# EasyEDA schematic sw63-display.json
TITLE: sw63 spacewatch; REV: 1.0; Date: 2019-05-05; Sheet: 1/1; Drawn By: Vaclav Mach; Company: xx0x
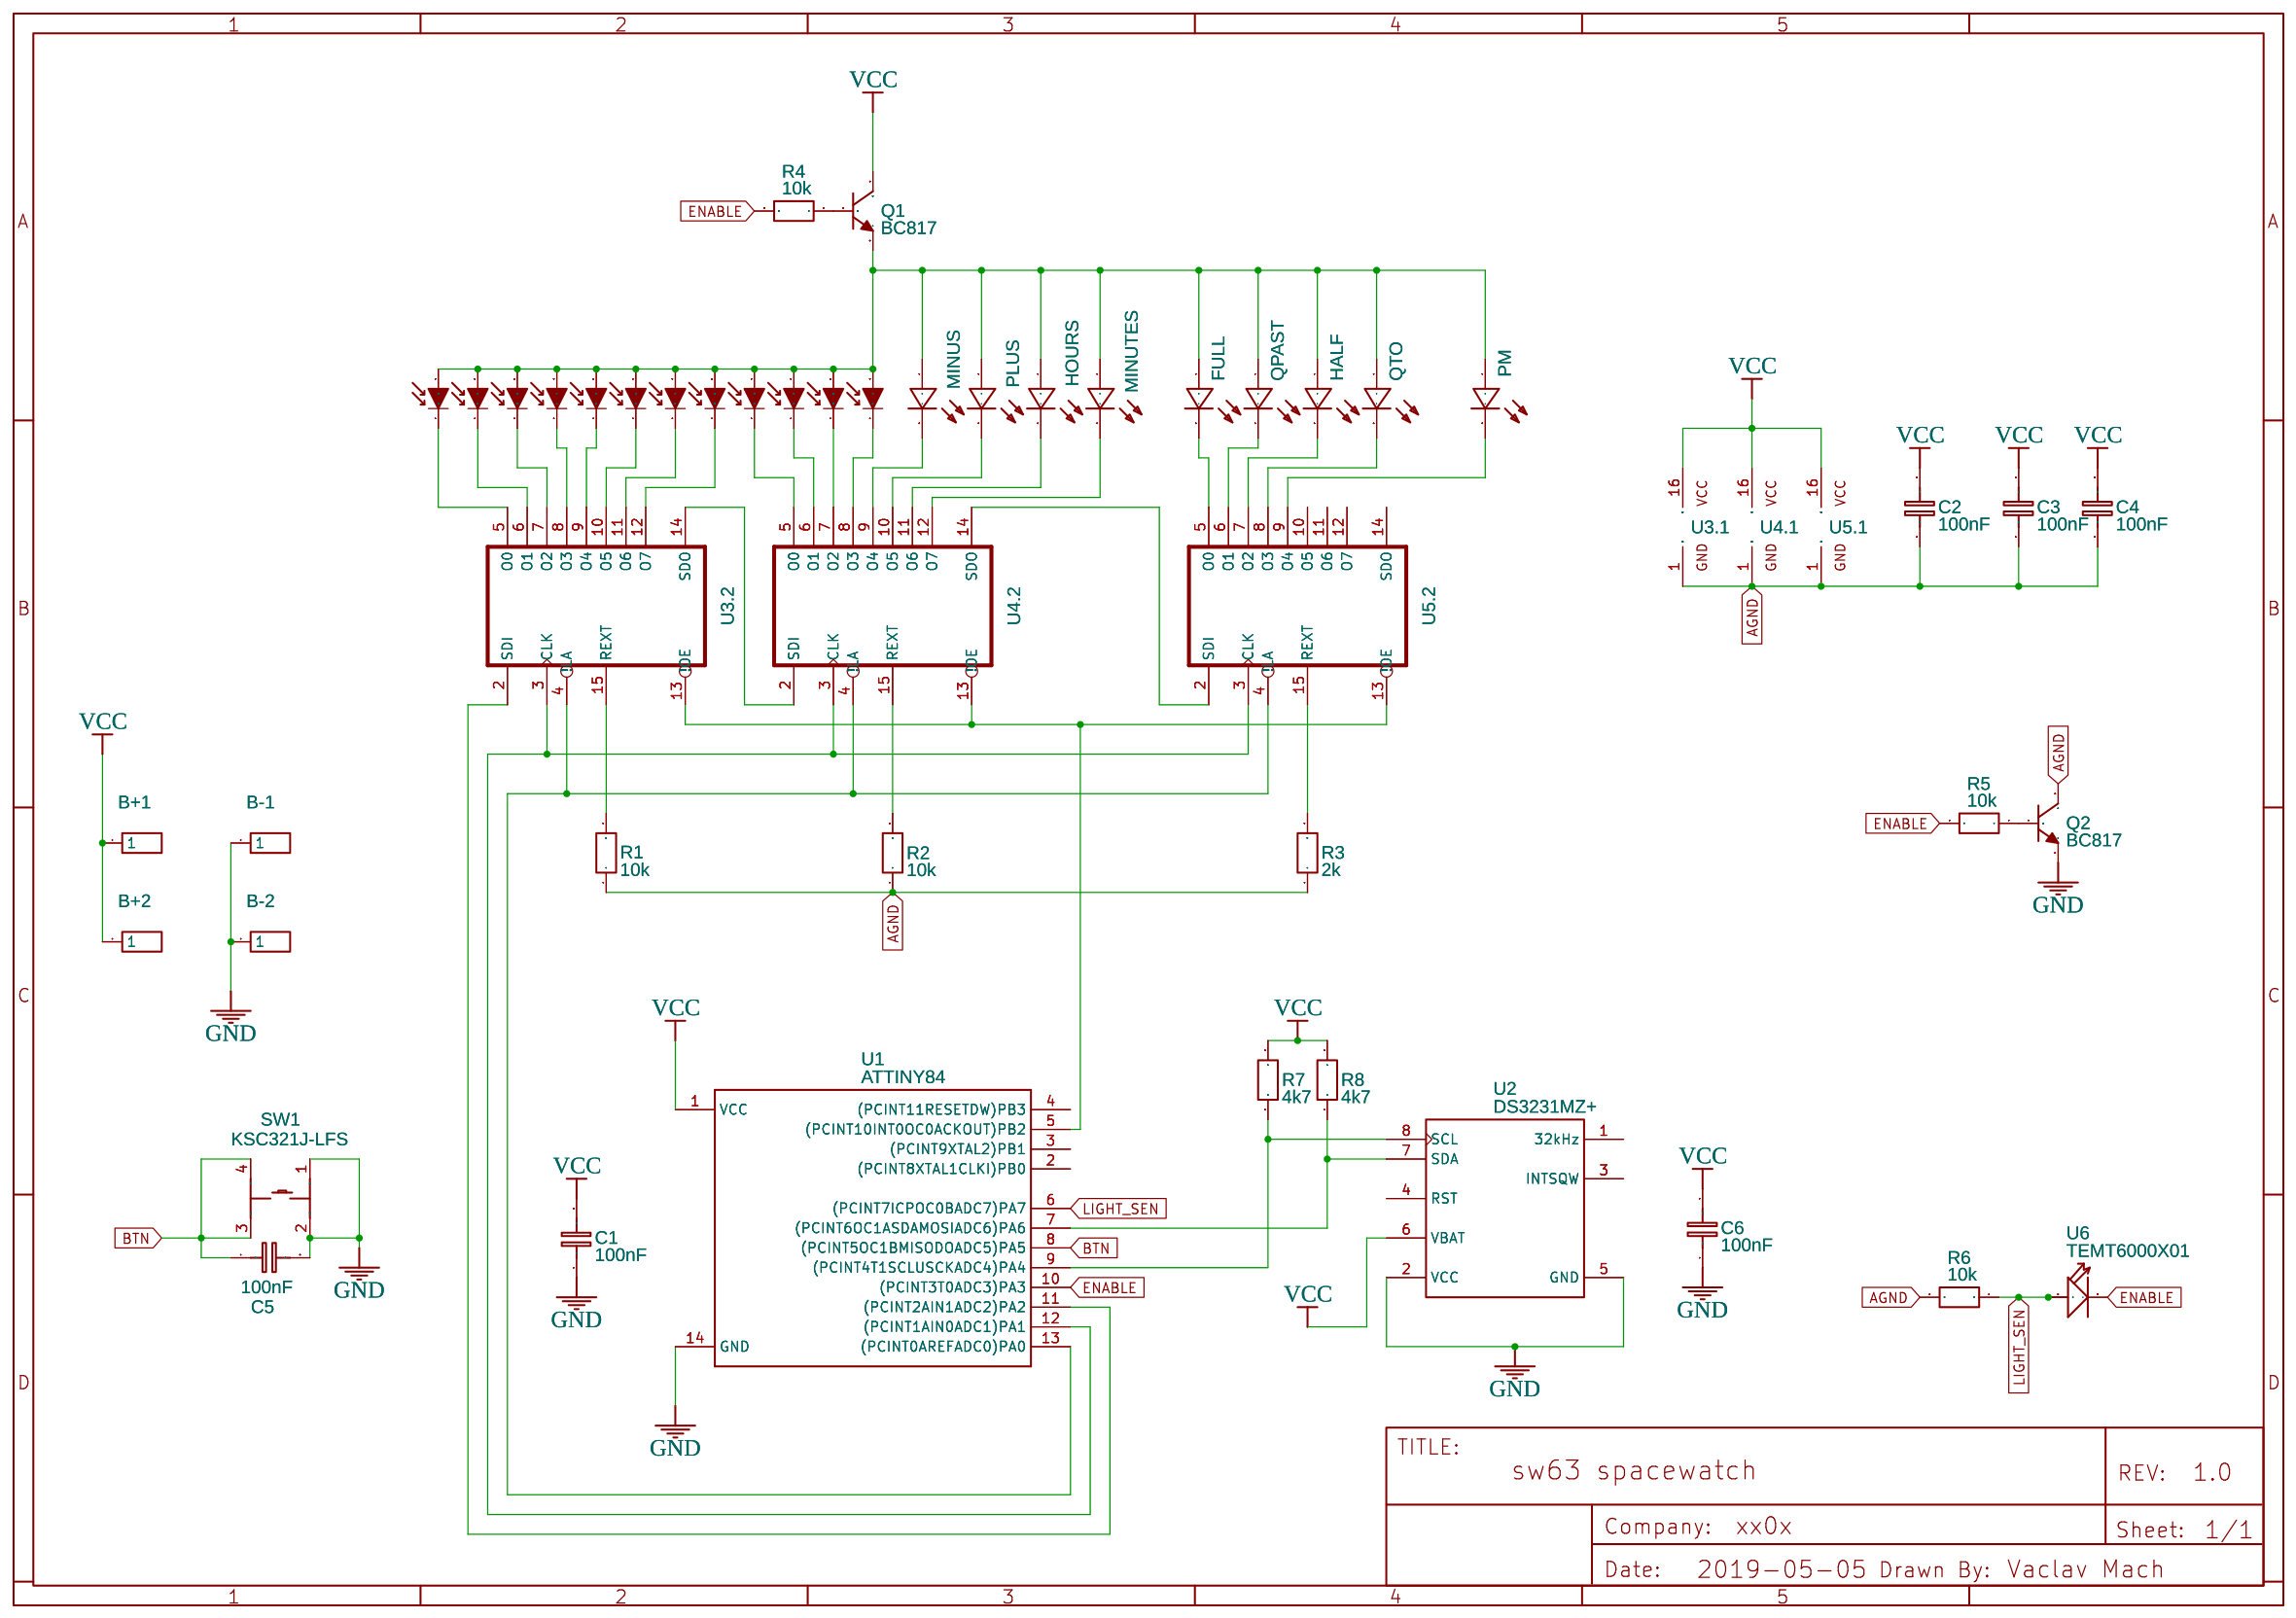
[diagram p0: schematic sheet]

## Parts
B+1  Header-Male-2.54_1x1  [ROUND-CONTACT]
B+2  Header-Male-2.54_1x1  [ROUND-CONTACT]
B-1  Header-Male-2.54_1x1  [ROUND-CONTACT]
B-2  Header-Male-2.54_1x1  [ROUND-CONTACT]
C1  100nF  [0603]
C2  100nF  [0603]
C3  100nF  [0603]
C4  100nF  [0603]
C5  100nF  [0603]
C6  100nF  [0603]
D1  LED  [LED_1206_NICE]
D2  LED  [LED_1206_NICE]
D3  LED  [LED_1206_NICE]
D4  LED  [LED_1206_NICE]
D5  LED  [LED_1206_NICE]
D6  LED  [LED_1206_NICE]
D7  LED  [LED_1206_NICE]
D8  LED  [LED_1206_NICE]
D9  LED  [LED_1206_NICE]
D10  LED  [LED_1206_NICE]
D11  LED  [LED_1206_NICE]
D12  LED  [LED_1206_NICE]
FULL  LED3.2x2  [LED-3.2X2-THT-RECTANGLE]
HALF  LED3.2x2  [LED-3.2X2-THT-RECTANGLE]
HOURS  LED-5MM  [LED-5MM/2.54]
MINUS  LED-5MM  [LED-5MM/2.54]
MINUTES  LED-5MM  [LED-5MM/2.54]
PLUS  LED-5MM  [LED-5MM/2.54]
PM  LED-3MM  [LED-3MM/2.54]
Q1  BC817  [SOT-23(SOT-23-3)]
Q2  BC817  [SOT-23(SOT-23-3)]
QPAST  LED3.2x2  [LED-3.2X2-THT-RECTANGLE]
QTO  LED3.2x2  [LED-3.2X2-THT-RECTANGLE]
R1  10k  [0603]
R2  10k  [0603]
R3  2k  [0603]
R4  10k  [0603]
R5  10k  [0603]
R6  10k  [0603]
R7  4k7  [0603]
R8  4k7  [0603]
SW1  KSC321J-LFS  [KSC341J]
U1  ATTINY84  [SO14]
U2  DS3231MZ+  [SOIC-8_150MIL]
U3  SCT2167CSSG  [SSOP16_OK]  (sections 1,2)
U4  SCT2167CSSG  [SSOP16_OK]  (sections 1,2)
U5  SCT2167CSSG  [SSOP16_OK]  (sections 1,2)
U6  TEMT6000X01  [SNR3-4X2X1.05MM_LARGER_PADS]

## Library data of the parts
C1-C6 = Cap_0805_EU: Manufacturer Part: ?
D1-D12 = -: Contributor: KiCAD; Manufacturer Part: LL-S150W-W2-1B; Supplier Part: LL-S150W-W2-1B; Manufacturer: LUCKY LIGHT; Supplier: TME
FULL HALF QPAST QTO = -: Supplier: TME; Manufacturer: LUCKY LIGHT; Manufacturer Part: LL-234YD2Q-1B; Supplier Part: LL-234YD2Q-1B
HOURS = -: Supplier: TME; Manufacturer: LUCKY LIGHT; Manufacturer Part: LL-504BD2E-B4-2B; Supplier Part: LL-504BD2E-B4-2B
MINUS = -: Supplier: TME; Manufacturer: LUCKY LIGHT; Manufacturer Part: LL-503VD2E-V1-4D; Supplier Part: LL-503VD2E-V1-4D
MINUTES = -: Supplier: TME; Manufacturer: KINGBRIGHT ELECTRONIC; Manufacturer Part: L-53SYDK; Supplier Part: L-53SYDK
PLUS = -: Supplier: TME; Manufacturer: LUCKY LIGHT; Manufacturer Part: LL-504PGD2E-G5-2B; Supplier Part: LL-504PGD2E-G5-2B
PM = -: Supplier: TME; Manufacturer: FORYARD; Manufacturer Part: FYL-3014LRD1A; Supplier Part: FYL-3014LRD1A
Q1 Q2 = -: Supplier: LCSC; Manufacturer: CJ; image: //image.lceda.cn/szlcsc/C8589.jpg; Supplier Part: C8589
R1-R8 = Res_0603(1/10W)_EU: Manufacturer Part: ?
SW1 = -: Supplier: TME; Supplier Part: KSC321J LFS; Manufacturer: C&K; Manufacturer Part: KSC321J LFS; Contributor: LCSC
U1 = -: Contributor: SparkFun; Manufacturer Part: ATTINY84A-SS; Supplier Part: ATTINY84A-SS; Supplier: TME; Manufacturer: MICROCHIP (ATMEL)
U2 = -: Supplier: LCSC; Manufacturer: MAXIM; Supplier Part: C107410; LCSC Assembly: Yes; SMT Type: Extend
U3 U4 = -: Package Display: No; Supplier: TME; Manufacturer: STARCHIPS TECHNOLOGY
U5 = -: Package Display: No; Manufacturer: STARCHIPS TECHNOLOGY; Supplier: TME
U6 = -: Supplier: TME; Manufacturer: VISHAY

## Nets
AGND: C2.1 C3.1 C4.1 Q2.3(C) R1.1 R2.1 R3.1 R6.2 U3.1(GND) U4.1(GND) U5.1(GND)
GND: B-1.1 B-2.1 C1.1 C5.2 C6.1 Q2.2(E) SW1.1 SW1.2 U1.14(GND) U2.2(VCC) U2.5(GND)
VCC: B+1.1 B+2.1 C1.2 C2.2 C3.2 C4.2 C6.2 Q1.3(C) R7.2 R8.2 U1.1(VCC) U2.6(VBAT) U3.16(VCC) U4.16(VCC) U5.16(VCC)
BTN: C5.1 SW1.3 SW1.4 U1.8((PCINT5OC1BMISODOADC5)PA5)
ENABLE: R4.2 R5.2 U1.10((PCINT3T0ADC3)PA3) U6.3(-)
LIGHT_SEN: R6.1 U1.6((PCINT7ICPOC0BADC7)PA7) U6.1(+) U6.2(+)
Net-(D1-1): D1.1(K) U3.5(O0)
Net-(D1-2): D1.2(A) D2.2(A) D3.2(A) D4.2(A) D5.2(A) D6.2(A) D7.2(A) D8.2(A) D9.2(A) D10.2(A) D11.2(A) D12.2(A) FULL.1(+) HALF.1(+) HOURS.1(+) MINUS.1(+) MINUTES.1(+) PLUS.1(+) PM.1(+) Q1.2(E) QPAST.1(+) QTO.1(+)
Net-(D2-1): D2.1(K) U3.6(O1)
Net-(D3-1): D3.1(K) U3.7(O2)
Net-(D4-1): D4.1(K) U3.8(O3)
Net-(D5-1): D5.1(K) U3.9(O4)
Net-(D6-1): D6.1(K) U3.10(O5)
Net-(D7-1): D7.1(K) U3.11(O6)
Net-(D8-1): D8.1(K) U3.12(O7)
Net-(D9-1): D9.1(K) U4.5(O0)
Net-(D10-1): D10.1(K) U4.6(O1)
Net-(D11-1): D11.1(K) U4.7(O2)
Net-(D12-1): D12.1(K) U4.8(O3)
Net-(FULL-2): FULL.2(-) U5.5(O0)
Net-(HALF-2): HALF.2(-) U5.7(O2)
Net-(HOURS-2): HOURS.2(-) U4.11(O6)
Net-(MINUS-2): MINUS.2(-) U4.9(O4)
Net-(MINUTES-2): MINUTES.2(-) U4.12(O7)
Net-(PLUS-2): PLUS.2(-) U4.10(O5)
Net-(PM-2): PM.2(-) U5.9(O4)
Net-(Q1-1): Q1.1(B) R4.1
Net-(Q2-1): Q2.1(B) R5.1
Net-(QPAST-2): QPAST.2(-) U5.6(O1)
Net-(QTO-2): QTO.2(-) U5.8(O3)
Net-(R1-2): R1.2 U3.15(REXT)
Net-(R2-2): R2.2 U4.15(REXT)
Net-(R3-2): R3.2 U5.15(REXT)
Net-(R7-1): R7.1 U1.9((PCINT4T1SCLUSCKADC4)PA4) U2.8(SCL)
Net-(R8-1): R8.1 U1.7((PCINT6OC1ASDAMOSIADC6)PA6) U2.7(SDA)
Net-(U1-5): U1.5((PCINT10INT0OC0ACKOUT)PB2) U3.13(!OE) U4.13(!OE) U5.13(!OE)
Net-(U1-11): U1.11((PCINT2AIN1ADC2)PA2) U3.2(SDI)
Net-(U1-12): U1.12((PCINT1AIN0ADC1)PA1) U3.3(CLK) U4.3(CLK) U5.3(CLK)
Net-(U1-13): U1.13((PCINT0AREFADC0)PA0) U3.4(!LA) U4.4(!LA) U5.4(!LA)
Net-(U3.2-14): U3.14(SDO) U4.2(SDI)
Net-(U4.2-14): U4.14(SDO) U5.2(SDI)

Not connected (* = marked no-connect by the designer): U1 2((PCINT8XTAL1CLKI)PB0) 3((PCINT9XTAL2)PB1) 4((PCINT11RESETDW)PB3); U2 1(32kHz) 3(INTSQW) 4(RST); U5 10(O5) 11(O6) 12(O7) 14(SDO)
